# Altium project MotorDriver_MegaProject.PrjPcb
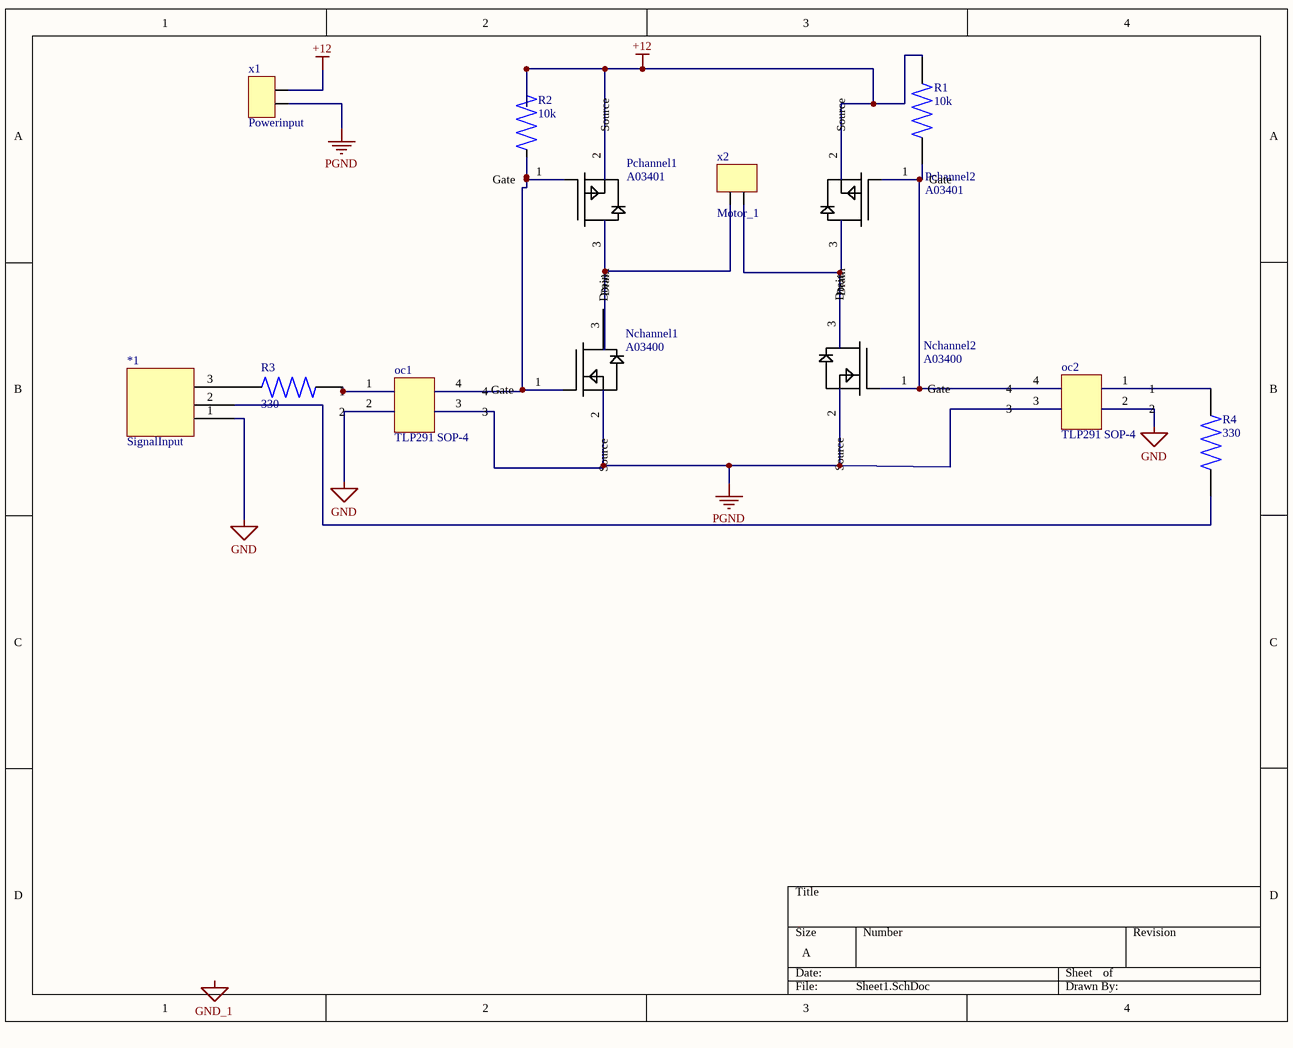
[diagram p0: Sheet1.SchDoc]
1 sheet, 13 parts. Net scope: global (net labels, ports and power ports of the same name join across sheets).
Board file: PCB1.PcbDoc

## Sheet Sheet1.SchDoc
size A; SheetNumber: 1; SheetTotal: 1

### Parts
*1  SignalInput  [Terminal block 3]
Nchannel1  A03400  [A03400]
Nchannel2  A03400  [A03400]
oc1  TLP291 SOP-4  [TLP291 SOP-4]
oc2  TLP291 SOP-4  [TLP291 SOP-4]
Pchannel1  A03401  [A03401]
Pchannel2  A03401  [A03401]
R1  10k  [resss_smd]
R2  10k  [resss_smd]
R3  330  [resss_smd]
R4  330  [resss_smd]
x1  Powerinput  [Terminal Block]
x2  Motor_1  [Terminal Block]

### Nets
+12: Pchannel1.2(Source) Pchannel2.2(Source) R1.2 R2.2 x1.2
GND: *1.1 oc1.2 oc2.2
PGND: Nchannel1.2(Source) Nchannel2.2(Source) oc1.3 oc2.3 x1.1
Net*1_2: *1.2 R4.2
Net*1_3: *1.3 R3.1
NetNchannel1_1: Nchannel1.1(Gate) oc1.4 Pchannel1.1(Gate) R2.1
NetNchannel1_3: Nchannel1.3(Drain) Pchannel1.3(Drain) x2.1
NetNchannel2_1: Nchannel2.1(Gate) oc2.4 Pchannel2.1(Gate) R1.1
NetNchannel2_3: Nchannel2.3(Drain) Pchannel2.3(Drain) x2.2
Netoc1_1: oc1.1 R3.2
Netoc2_1: oc2.1 R4.1

### Notes on the sheet
- Labels drawn without touching a wire or pin: GND_1

### Library data of the parts
*1 = Terminal block 3
R1-R4 = resss_smd: 910 Ohms Â±1% 0.125W, 1/8W Chip Resistor 0805 (2012 Metric) Moisture Resistant Thick Film; MF: Yageo; MP: RC0805FR-07910RL; Package: 2012 Rohm Semiconductor; Value: *; Purchase-URL: https://pricing.snapeda.com/search/part/RC0805FR-07910RL/?ref=eda; Availability: In Stock; Price: None
x1 x2 = Terminal Block